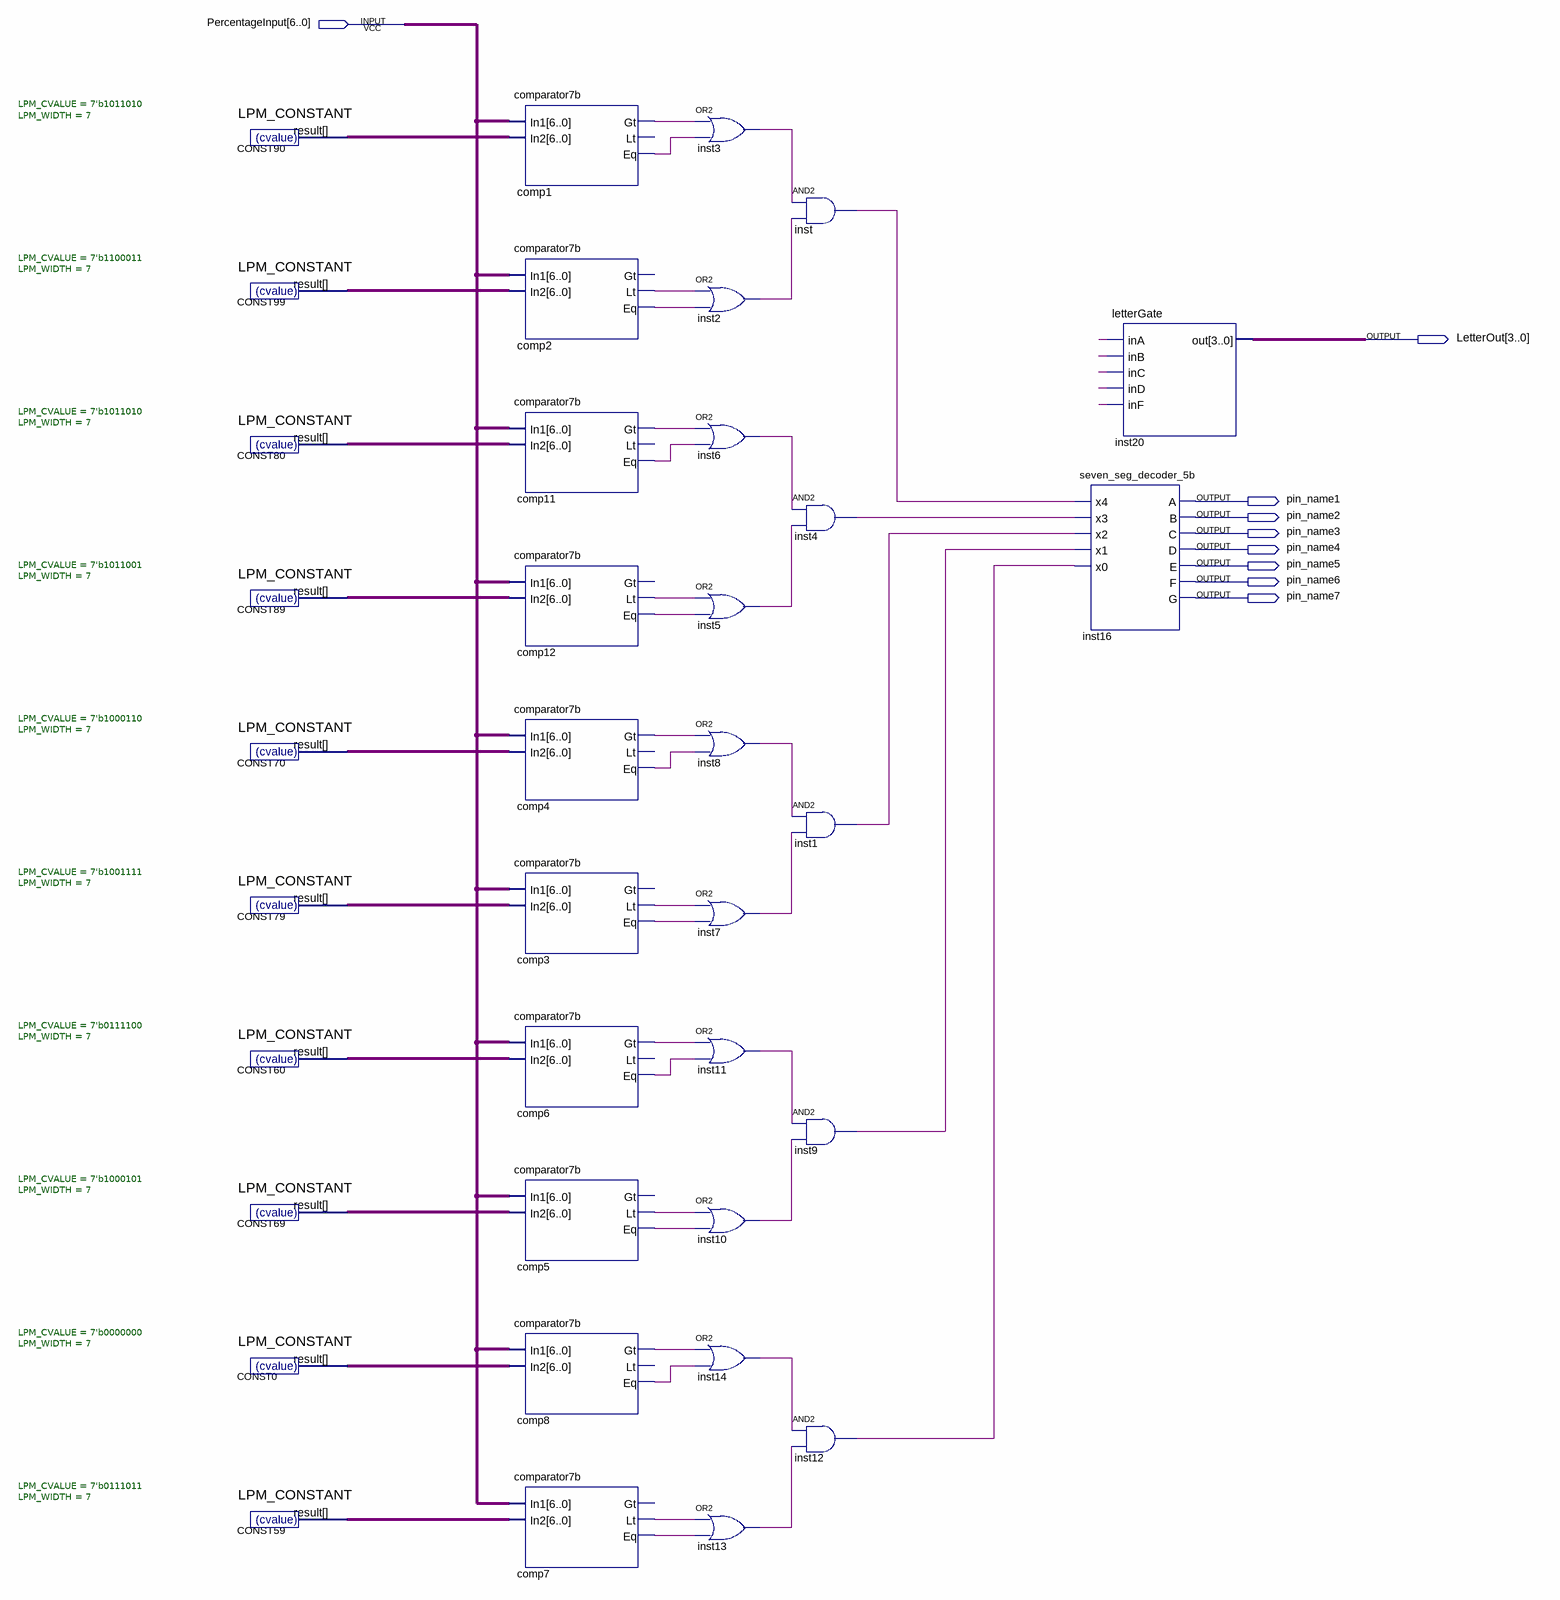
[diagram p0: schematic sheet]
// Quartus schematic letterGeneratorBDF.bdf as structural Verilog: 37 symbols, 9 pins
module letterGeneratorBDF (
  input  [6:0] PercentageInput,
  output [3:0] LetterOut,
  output pin_name1,
  output pin_name2,
  output pin_name3,
  output pin_name4,
  output pin_name5,
  output pin_name6,
  output pin_name7
);

  wire comp1_eq, comp1_gt, comp2_eq, comp2_lt, comp3_eq, comp3_lt, comp4_eq, comp4_gt, comp5_eq, comp5_lt,
       comp6_eq, comp6_gt, comp7_eq, comp7_lt, comp8_eq, comp8_gt, comp11_eq, comp11_gt, comp12_eq,
       comp12_lt, inst1_out, inst2_out, inst3_out, inst4_out, inst5_out, inst6_out, inst7_out, inst8_out,
       inst9_out, inst10_out, inst11_out, inst12_out, inst13_out, inst14_out, inst_out, undriven, undriven_2,
       undriven_3, undriven_4, undriven_5;
  wire [6:0] CONST0_result, CONST59_result, CONST60_result, CONST69_result, CONST70_result, CONST79_result,
       CONST80_result, CONST89_result, CONST90_result, CONST99_result;

  LPM_CONSTANT #(.LPM_CVALUE(7'b1011010), .LPM_WIDTH(7)) CONST90 (.result(CONST90_result));
  LPM_CONSTANT #(.LPM_CVALUE(7'b1100011), .LPM_WIDTH(7)) CONST99 (.result(CONST99_result));
  LPM_CONSTANT #(.LPM_CVALUE(7'b1011010), .LPM_WIDTH(7)) CONST80 (.result(CONST80_result));
  LPM_CONSTANT #(.LPM_CVALUE(7'b1011001), .LPM_WIDTH(7)) CONST89 (.result(CONST89_result));
  LPM_CONSTANT #(.LPM_CVALUE(7'b1000110), .LPM_WIDTH(7)) CONST70 (.result(CONST70_result));
  LPM_CONSTANT #(.LPM_CVALUE(7'b1001111), .LPM_WIDTH(7)) CONST79 (.result(CONST79_result));
  LPM_CONSTANT #(.LPM_CVALUE(7'b0111100), .LPM_WIDTH(7)) CONST60 (.result(CONST60_result));
  LPM_CONSTANT #(.LPM_CVALUE(7'b1000101), .LPM_WIDTH(7)) CONST69 (.result(CONST69_result));
  LPM_CONSTANT #(.LPM_CVALUE(7'b0000000), .LPM_WIDTH(7)) CONST0 (.result(CONST0_result));
  LPM_CONSTANT #(.LPM_CVALUE(7'b0111011), .LPM_WIDTH(7)) CONST59 (.result(CONST59_result));
  comparator7b comp1 (.In1(PercentageInput), .In2(CONST90_result), .Gt(comp1_gt), .Eq(comp1_eq));  // open: Lt
  comparator7b comp2 (.In1(PercentageInput), .In2(CONST99_result), .Lt(comp2_lt), .Eq(comp2_eq));  // open: Gt
  comparator7b comp11 (.In1(PercentageInput), .In2(CONST80_result), .Gt(comp11_gt), .Eq(comp11_eq));  // open: Lt
  comparator7b comp12 (.In1(PercentageInput), .In2(CONST89_result), .Lt(comp12_lt), .Eq(comp12_eq));  // open: Gt
  comparator7b comp4 (.In1(PercentageInput), .In2(CONST70_result), .Gt(comp4_gt), .Eq(comp4_eq));  // open: Lt
  comparator7b comp3 (.In1(PercentageInput), .In2(CONST79_result), .Lt(comp3_lt), .Eq(comp3_eq));  // open: Gt
  comparator7b comp6 (.In1(PercentageInput), .In2(CONST60_result), .Gt(comp6_gt), .Eq(comp6_eq));  // open: Lt
  comparator7b comp5 (.In1(PercentageInput), .In2(CONST69_result), .Lt(comp5_lt), .Eq(comp5_eq));  // open: Gt
  comparator7b comp8 (.In1(PercentageInput), .In2(CONST0_result), .Gt(comp8_gt), .Eq(comp8_eq));  // open: Lt
  comparator7b comp7 (.In1(PercentageInput), .In2(CONST59_result), .Lt(comp7_lt), .Eq(comp7_eq));  // open: Gt
  or inst3 (inst3_out, comp1_gt, comp1_eq);
  or inst2 (inst2_out, comp2_lt, comp2_eq);
  or inst6 (inst6_out, comp11_gt, comp11_eq);
  or inst5 (inst5_out, comp12_lt, comp12_eq);
  or inst8 (inst8_out, comp4_gt, comp4_eq);
  or inst7 (inst7_out, comp3_lt, comp3_eq);
  or inst11 (inst11_out, comp6_gt, comp6_eq);
  or inst10 (inst10_out, comp5_lt, comp5_eq);
  or inst14 (inst14_out, comp8_gt, comp8_eq);
  or inst13 (inst13_out, comp7_lt, comp7_eq);
  and inst (inst_out, inst3_out, inst2_out);
  and inst4 (inst4_out, inst6_out, inst5_out);
  and inst1 (inst1_out, inst8_out, inst7_out);
  and inst9 (inst9_out, inst11_out, inst10_out);
  and inst12 (inst12_out, inst14_out, inst13_out);
  letterGate inst20 (
    .inA(undriven), .inB(undriven_5), .inC(undriven_2), .inD(undriven_4), .inF(undriven_3), .out(LetterOut));
  seven_seg_decoder_5b inst16 (
    .x4(inst_out), .x3(inst4_out), .x2(inst1_out), .x1(inst9_out), .x0(inst12_out), .A(pin_name1),
    .B(pin_name2), .C(pin_name3), .D(pin_name4), .E(pin_name5), .F(pin_name6), .G(pin_name7));
endmodule
